# Altium project LNA.PrjPCB
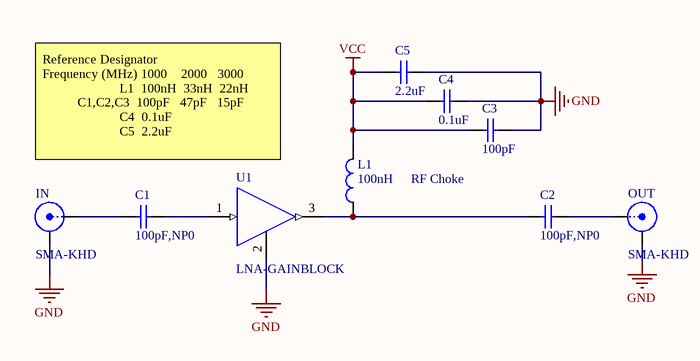
[diagram p0: LNA.SchDoc]
1 sheet, 9 parts. Net scope: global (net labels, ports and power ports of the same name join across sheets).
Board file: LNA.PcbDoc

## Sheet LNA.SchDoc
size A4

### Parts
C1  100pF,NP0  [0603_C]
C2  100pF,NP0  [0603_C]
C3  100pF  [0603_C]
C4  0.1uF  [0603_C]
C5  2.2uF  [0603_C]
IN  SMA-KHD  [SMA-2]
L1  100nH  [0603]
OUT  SMA-KHD  [SMA-2]
U1  LNA-GAINBLOCK  [SOT-89]

### Nets
GND: C3.2 C4.2 C5.2 IN.1(Y) OUT.1(Y) U1.2(V-)
VCC: C3.1 C4.1 C5.1 L1.2
NetC1_1: C1.1 IN.2(X)
NetC1_2: C1.2 U1.1(IN+)
NetC2_1: C2.1 OUT.2(X)
NetC2_2: C2.2 L1.1 U1.3(OUT)

### Notes on the sheet
- Reference Designator
  Frequency (MHz) 1000    2000   3000
  L1  100nH  33nH  22nH
  C1,C2,C3  100pF   47pF   15pF
  C4  0.1uF
  C5  2.2uF
- RF Choke

### Library data of the parts
C1-C5 = CAP: Capacitor; Value: 104; Published: 8-Jun-2000; LatestRevisionDate: 17-Jul-2002; LatestRevisionNote: Re-released for DXP Platform.; PackageReference: RAD-0.3; Publisher: Altium Limited
IN OUT = SMA_KHD
L1 = L_Inductance
U1 = LNA